# EAGLE schematic base_board (EAGLE 9.5.1)
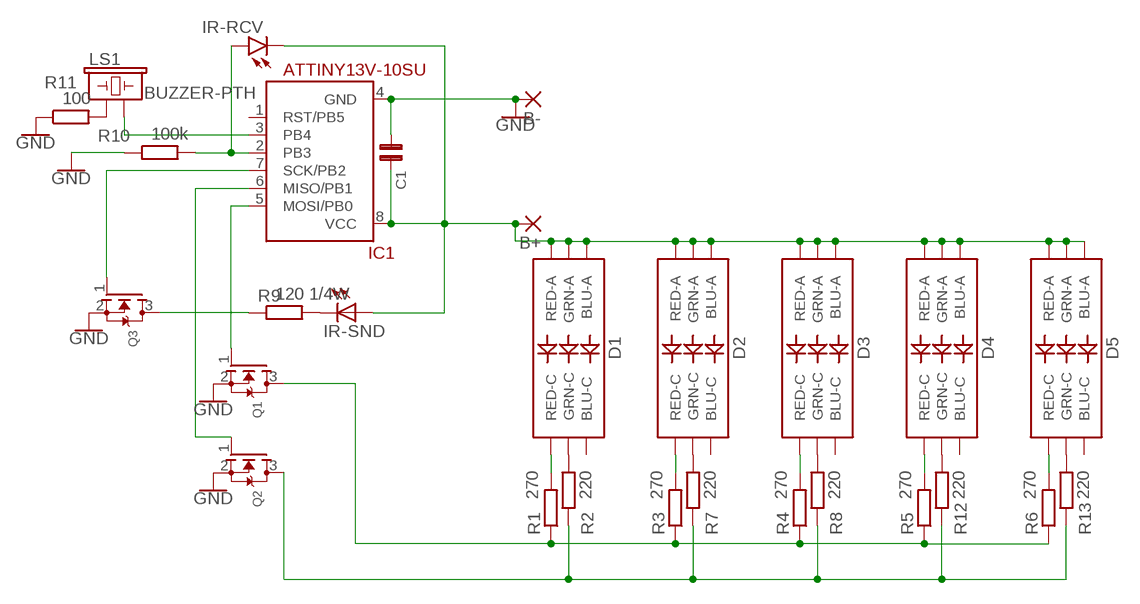
[diagram p0: schematic, sheet 1]

## Parts
B+  2,15/1,0  [2,15/1,0]
B-  2,15/1,0  [2,15/1,0]
C1  C0805  [0805]
D1  LED-RGBNO_IC  [LED-TRICOLOR-5050]
D2  LED-RGBNO_IC  [LED-TRICOLOR-5050]
D3  LED-RGBNO_IC  [LED-TRICOLOR-5050]
D4  LED-RGBNO_IC  [LED-TRICOLOR-5050]
D5  LED-RGBNO_IC  [LED-TRICOLOR-5050]
IC1  ATTINY13V-10SU  [SOIC8]
IR-RCV  LED_INPUT  [LED3MM]
IR-SND  LED3MM  [LED3MM]
LS1  BUZZER-PTH  [BUZZER-12MM]
Q1  MOSFET-NREFLOW  [SOT23]
Q2  MOSFET-NREFLOW  [SOT23]
Q3  MOSFET-NREFLOW  [SOT23]
R1  270  R-EU_R2012  [R2012]
R2  220  R-EU_R2012  [R2012]
R3  270  R-EU_R2012  [R2012]
R4  270  R-EU_R2012  [R2012]
R5  270  R-EU_R2012  [R2012]
R6  270  R-EU_R2012  [R2012]
R7  220  R-EU_R2012  [R2012]
R8  220  R-EU_R2012  [R2012]
R9  120 1/4W  R-EU_R2012  [R2012]
R10  100k  R-EU_R2012  [R2012]
R11  100  R-EU_R2012  [R2012]
R12  220  R-EU_R2012  [R2012]
R13  220  R-EU_R2012  [R2012]

## Nets
GND: B-.1(P) C1.1 IC1.4(GND) Q1.2(S) Q2.2(S) Q3.2(S) R10.1 R11.1
N$1: D2.5(RED-C) R3.2
N$2: D1.5(RED-C) R1.2
N$3: B+.1(P) C1.2 D1.1(GRN-A) D1.2(RED-A) D1.3(BLU-A) D2.1(GRN-A) D2.2(RED-A) D2.3(BLU-A) D3.1(GRN-A) D3.2(RED-A) D3.3(BLU-A) D4.1(GRN-A) D4.2(RED-A) D4.3(BLU-A) D5.1(GRN-A) D5.2(RED-A) D5.3(BLU-A) IC1.8(VCC) IR-RCV.K(C) IR-SND.A
N$4: D3.5(RED-C) R4.2
N$5: D4.5(RED-C) R5.2
N$6: D5.5(RED-C) R6.2
N$7: D1.6(GRN-C) R2.2
N$8: D2.6(GRN-C) R7.2
N$9: D3.6(GRN-C) R8.2
N$10: IC1.5(MOSI/PB0) Q1.1(G)
N$11: IC1.6(MISO/PB1) Q2.1(G)
N$12: D4.6(GRN-C) R12.2
N$13: Q2.3(D) R2.1 R7.1 R8.1 R12.1 R13.1
N$14: IC1.7(SCK/PB2) Q3.1(G)
N$15: Q3.3(D) R9.1
N$16: IR-SND.K(C) R9.2
N$17: IC1.2(PB3) IR-RCV.A R10.2
N$18: LS1.+ R11.2
N$19: IC1.3(PB4) LS1.-
N$20: Q1.3(D) R1.1 R3.1 R4.1 R5.1 R6.1
N$21: D5.6(GRN-C) R13.2
Unconnected: D1.4(BLU-C) D2.4(BLU-C) D3.4(BLU-C) D4.4(BLU-C) D5.4(BLU-C) IC1.1(RST/PB5)

## Library data of the parts
B+ B- = wirepad:2,15/1,0: THROUGH-HOLE PAD
C1 = capsmd:C0805
D1-D5 = SparkFun-LED:LED-RGB: LED-RGB 6 pin RGB LED (no common connector) Packages: PLCC-6 LED-TRICOLOR-5050 - No built-in IC SparkFun Products: Digital Sandbox <https://www.sparkfun.com/products/12651> LED- SMD RGB <https://www.sparkfun.com/products/10866>; PROD_ID: DIO-10298
IC1 = attiny13:ATTINY13V-10*
IR-RCV = led:LED_INPUT: LED IR LED input
IR-SND = adafruit:LED: LED OSRAM: - CHIPLED LG R971, LG N971, LY N971, LG Q971, LY Q971, LO R971, LY R971 LH N974, LH R974 LS Q976, LO Q976, LY Q976 LO Q996 - Hyper CHIPLED LW Q18S LB Q993, LB Q99A, LB R99A - SideLED LS A670, LO A670, LY A670, LG A670, LP A670 LB A673, LV A673, LT A673, LW A673 LH A674 LY A675 LS A676, LA A676, LO A676, LY A676, LW A676 LS A679, LY A679, LG A679 - Hyper Micro SIDELED® LS Y876, LA Y876, LO Y876, LY Y876 LT Y87S - SmartLED LW L88C, LW L88S LB L89C, LB L89S, LG L890 LS L89K, LO L89K, LY L89K LS L896, LA L896, LO L896, LY L896 - TOPLED LS T670, LO T670, LY T670, LG T670, LP T670 LSG T670, LSP T670, LSY T670, LOP T670, LYG T670 LG T671, LOG T671, LSG T671 LB T673, LV T673, LT T673, LW T673 LH T674 LS T676, LA T676, LO T676, LY T676, LB T676, LH T676, LSB T676, LW T676 LB T67C, LV T67C, LT T67C, LS T67K, LO T67K, LY T67K, LW E67C LS E67B, LA E67B, LO E67B, LY E67B, LB E67C, LV E67C, LT E67C LW T67C LS T679, LY T679, LG T679 LS T770, LO T770, LY T770, LG T770, LP T770 LB T773, LV T773, LT T773, LW T773 LH T774 LS E675, LA E675, LY E675, LS T675 LS T776, LA T776, LO T776, LY T776, LB T776 LHGB T686 LT T68C, LB T68C - Hyper Mini TOPLED® LB M676 - Mini TOPLED Santana® LG M470 LS M47K, LO M47K, LY M47K Source: http://www.osram.convergy.de/
LS1 = SparkFun-Electromechanical:BUZZER: Buzzer Small round buzzers that operate around the audible 2kHz range. You can use these as speakers to create simple music or user interfaces. Variant Overview: PTH - Mini Speaker - PC Mount 12mm 2.048kHz <https://www.sparkfun.com/products/7950> PTH_KIT - Mini Speaker - PC Mount 12mm 2.048kHz <https://www.sparkfun.com/products/7950> KIT simplifies soldering by adding stop mask to one side of the pads. PTH_NO_SILK - Mini Speaker - PC Mount 12mm 2.048kHz <https://www.sparkfun.com/products/7950> No silkscreen indicator of buzzer outline. PTH_KIT_NO_SILK - Mini Speaker - PC Mount 12mm 2.048kHz <https://www.sparkfun.com/products/7950> KIT package w/o silkscreen SMD - Buzzer Audio Magnetic (CCV-084B16) SMD buzzer used on, e.g. the LilyPad Buzzer <https://www.sparkfun.com/products/8463> and RFID USB Reader <https://www.sparkfun.com/products/9963>. SMD_KIT - Buzzer Audio Magnetic (CCV-084B16) SMD Buzzer with elongated pins to make soldering easier. Used on the SparkFun Simon Says - Surface Mount Soldering Kit <https://www.sparkfun.com/products/10935>.; PROD_ID: COMP-08253; SF_SKU: COM-07950
Q1-Q3 = adafruit:MOSFET-N: N-Channel Mosfet 2N7002E - 60V 260mA SOT23 [Digikey: 2N7002ET1GOSTR-ND] - REEL BSH103 - 30V 850mA SOT23 [Digikey: 568-5013-1-ND]
R1-R13 = resistor:R-EU_: RESISTOR, European symbol